# EAGLE design SARA (EAGLE 9.3.0)
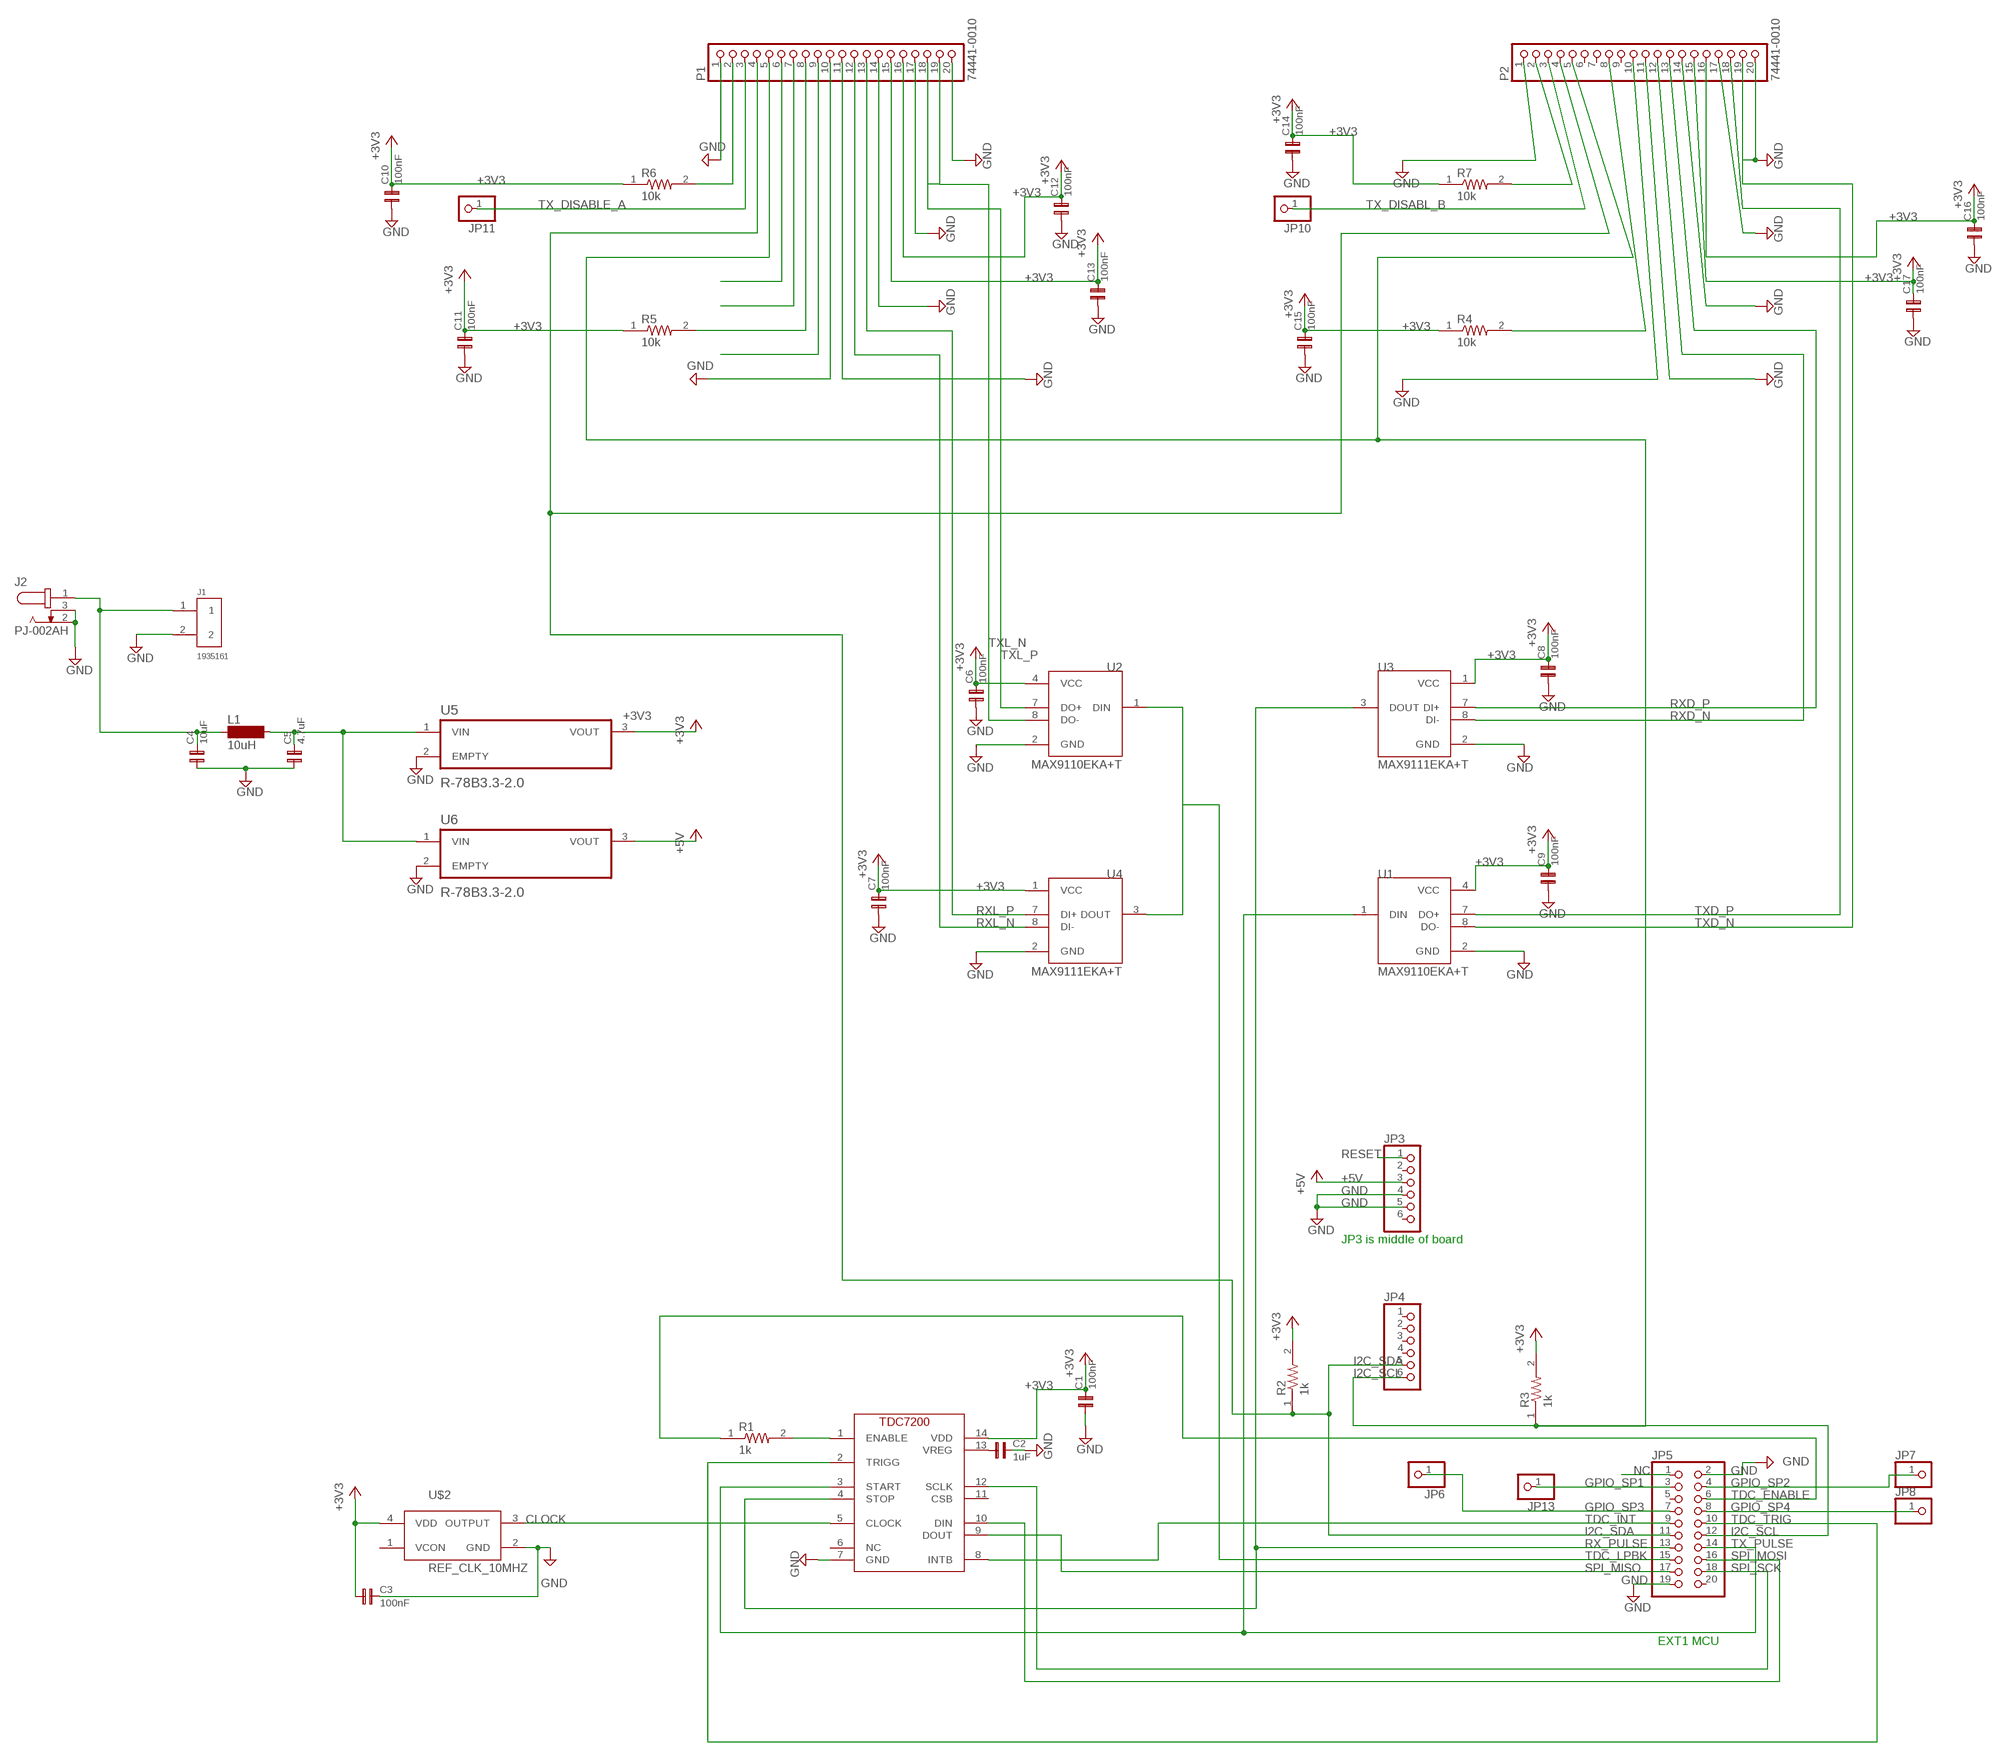
[diagram p0: schematic, sheet 1]

## Parts
C1  100nF  C0603  [0603]
C2  1uF  C0603  [0603]
C3  100nF  C0603  [0603]
C4  10uF  C0603  [0603]
C5  4.7uF  C0603  [0603]
C6  100nF  C0603  [0603]
C7  100nF  C0603  [0603]
C8  100nF  C0603  [0603]
C9  100nF  C0603  [0603]
C10  100nF  C0603  [0603]
C11  100nF  C0603  [0603]
C12  100nF  C0603  [0603]
C13  100nF  C0603  [0603]
C14  100nF  C0603  [0603]
C15  100nF  C0603  [0603]
C16  100nF  C0603  [0603]
C17  100nF  C0603  [0603]
J1  1935161  [PHOENIX_1935161]
J2  PJ-002AH  [CUI_PJ-002AH]
JP3  PINHD-1X6  [1X06]
JP4  PINHD-1X6  [1X06]
JP5  PINHD-2X10  [2X10]
JP6  PINHD-1X1  [1X01]
JP7  PINHD-1X1  [1X01]
JP8  PINHD-1X1  [1X01]
JP10  PINHD-1X1  [1X01]
JP11  PINHD-1X1  [1X01]
JP13  PINHD-1X1  [1X01]
L1  10uH  MS50  [MS50]
P1  74441-0010  [MOLEX_74441-0010]
P2  74441-0010  [MOLEX_74441-0010]
R1  1k  RES_0603  [RESC1608X55]
R2  1k  RES_0603  [RESC1608X55]
R3  1k  RES_0603  [RESC1608X55]
R4  10k  RES_0603  [RESC1608X55]
R5  10k  RES_0603  [RESC1608X55]
R6  10k  RES_0603  [RESC1608X55]
R7  10k  RES_0603  [RESC1608X55]
U1  MAX9110EKA+T  [SOT65P280X145-8N]
U2  MAX9110EKA+T  [SOT65P280X145-8N]
U3  MAX9111EKA+T  [SOT65P280X145-8N]
U4  MAX9111EKA+T  [SOT65P280X145-8N]
U5  R-78B3.3-2.0  [CONV_R-78B15-2.0]
U6  R-78B3.3-2.0  [CONV_R-78B15-2.0]
U$1  TDC72007201PW  [SOP65P640X120-14N]
U$2  REF_CLK_10MHZ  [TWETMCJANF-10.000000]

## Nets
+3V3: C1.2 C3.1 C6.2 C7.2 C8.2 C9.2 C10.2 C11.2 C12.2 C13.2 C14.2 C15.2 C16.2 C17.2 P1.15 P1.16 P2.15 P2.16 R2.2 R3.2 R4.1 R5.1 R6.1 R7.1 U1.4(VCC) U2.4(VCC) U3.1(VCC) U4.1(VCC) U5.3(VOUT) U$1.14(VDD) U$2.4(VDD)
+5V: JP3.3 U6.3(VOUT)
CLOCK: U$1.5(CLOCK) U$2.3(OUTPUT)
GND: C1.1 C2.2 C3.2 C4.1 C5.1 C6.1 C7.1 C8.1 C9.1 C10.1 C11.1 C12.1 C13.1 C14.1 C15.1 C16.1 C17.1 J1.2 J2.2 J2.3 JP3.4 JP3.5 JP5.2 JP5.19 P1.1 P1.10 P1.11 P1.14 P1.17 P1.20 P2.1 P2.11 P2.14 P2.17 P2.20 U1.2(GND) U2.2(GND) U3.2(GND) U4.2(GND) U5.2(EMPTY) U6.2(EMPTY) U$1.7(GND) U$2.2(GND)
GPIO_SP1: JP5.3 JP13.1
GPIO_SP2: JP5.4 JP7.1
GPIO_SP3: JP5.7 JP6.1
GPIO_SP4: JP5.8 JP8.1
I2C_SCL: JP4.6 JP5.12 P1.5 P2.5 R3.1
I2C_SDA: JP4.5 JP5.11 P1.4 P2.4 R2.1
N$1: P2.8 R4.2
N$2: R1.2 U$1.1(ENABLE)
N$3: P1.6
N$4: C2.1 U$1.13(VREG)
N$5: P1.7
N$6: P1.9
N$7: P2.10 ; supply symbol labelled GND
N$9: C5.2 L1.2 U5.1(VIN) U6.1(VIN)
N$18: U2.1(DIN) U4.3(DOUT)
N$19: P1.8 R5.2
N$20: P1.2 R6.2
N$21: P2.2 R7.2
N$22: C4.2 J1.1 J2.1 L1.1
NC: JP5.1
RESET: JP3.1
RX_PULSE: JP5.13 U3.3(DOUT) U$1.4(STOP)
RXD_N [Diff]: P2.12 U3.8(DI-)
RXD_P [Diff]: P2.13 U3.7(DI+)
RXL_N [Diff]: P1.12 U4.8(DI-)
RXL_P [Diff]: P1.13 U4.7(DI+)
SPI_MISO: JP5.17 U$1.9(DOUT)
SPI_MOSI: JP5.16 U$1.10(DIN)
SPI_SCK: JP5.18 U$1.12(SCLK)
TDC_ENABLE: JP5.6 R1.1
TDC_INT: JP5.9 U$1.8(INTB)
TDC_LPBK: JP5.15
TDC_TRIG: JP5.10 U$1.2(TRIGG)
TX_DISABL_B: JP10.1 P2.3
TX_DISABLE_A: JP11.1 P1.3
TX_PULSE: JP5.14 U1.1(DIN) U$1.3(START)
TXD_N [Diff]: P2.19 U1.8(DO-)
TXD_P [Diff]: P2.18 U1.7(DO+)
TXL_N [Diff]: P1.19 U2.8(DO-)
TXL_P [Diff]: P1.18 U2.7(DO+)
Unconnected: JP3.2 JP3.6 JP4.1 JP4.2 JP4.3 JP4.4 JP5.5 JP5.20 P2.6 P2.7 P2.9 U$1.6(NC) U$1.11(CSB) U$2.1(VCON)

## Notes on the sheet
- JP3 is middle of board
- EXT1 MCU

## Library data of the parts
C1-C17 = capsmd:C0603
J1 = Screw Block:1935161: Conn Terminal Blocks 2 POS 5mm Solder ST Thru-Hole 16A; AVAILABILITY: Unavailable; DESCRIPTION: Conn Terminal Blocks 2 POS 5mm Solder ST Thru-Hole 16A; MF: Phoenix Contact; MP: 1935161; PACKAGE: None; PRICE: None
J2 = PJ-002AH:PJ-002AH: 2.0 mm Center Pin, 5.0 A, Right Angle, Through Hole, Dc Power Jack Connector; AVAILABILITY: Unavailable; CUI_PURCHASE_URL: https://www.cui.com/product/interconnect/dc-power-connectors/jacks/2.0-mm-center-pin/pj-002ah?utm_source=snapeda.com&utm_medium=referral&utm_campaign=snapedaBOM; DESCRIPTION: 2.0 mm Center Pin, 5.0 A, Right Angle, Through Hole, Dc Power Jack Connector; MF: CUI Inc.; MP: PJ-002AH; PACKAGE: None; PRICE: None
JP3 JP4 = pinhead:PINHD-1X6: PIN HEADER
JP5 = pinhead:PINHD-2X10: PIN HEADER
JP6-JP8 JP10 JP11 JP13 = pinhead:PINHD-1X1: PIN HEADER
L1 = inductor-neosid:MS50: INDUCTOR SMD power inductor; OC_FARNELL: unknown; OC_NEWARK: unknown
P1 P2 = 74441-0010:74441-0010: 0.80mm Pitch SFP, SFP Plus (SFP+) Host Connector, Z-Axis Pluggable, Right Angle, SMT, 20 Circuits, 0.76µm Gold (Au); AVAILABILITY: Unavailable; DESCRIPTION: 0.80mm Pitch SFP, SFP Plus _SFP+_ Host Connector, Z-Axis Pluggable, Right Angle, SMT, 20 Circuits, 0.76µm Gold _Au_; MF: Molex; MP: 74441-0010; PACKAGE: None; PRICE: None
R1-R7 = RES_0603:RES_0603; AVAILABILITY: Unavailable; DESCRIPTION: Res Smd 0.047 Ohm 1% 0.4w 0603; MF: Vishay Dale; MP: WSLP0603R0470FEB; PACKAGE: 0603 Vishay Dale; PRICE: None
U1 U2 = MAX9110EKA_T:MAX9110EKA+T: The MAX9110 is a single LVDS transmitter; AVAILABILITY: Unavailable; DESCRIPTION: Single/Dual Lvds Line Driver With u; MF: Maxim Integrated; MP: MAX9110EKA+T; PACKAGE: SOT-23 Maxim Integrated; PRICE: None
U3 U4 = MAX9111EKA_T:MAX9111EKA+T
U5 U6 = R-78B3.3-2.0:R-78B3.3-2.0: None; AVAILABILITY: Unavailable; DESCRIPTION: Switching Regulator 4.75-32Vin 3.3Vo 2A; MF: Recom Power; MP: R-78B3.3-2.0; PACKAGE: SIP-3 Recom Power; PRICE: None
U$1 = TDC7200:TDC7200: TDC7200 chip made by Joe
U$2 = Ref_Clk:REF_CLK_10MHZ

## Net classes
1 Diff: width 0.254 mm, clearance 0.051 mm

## Board
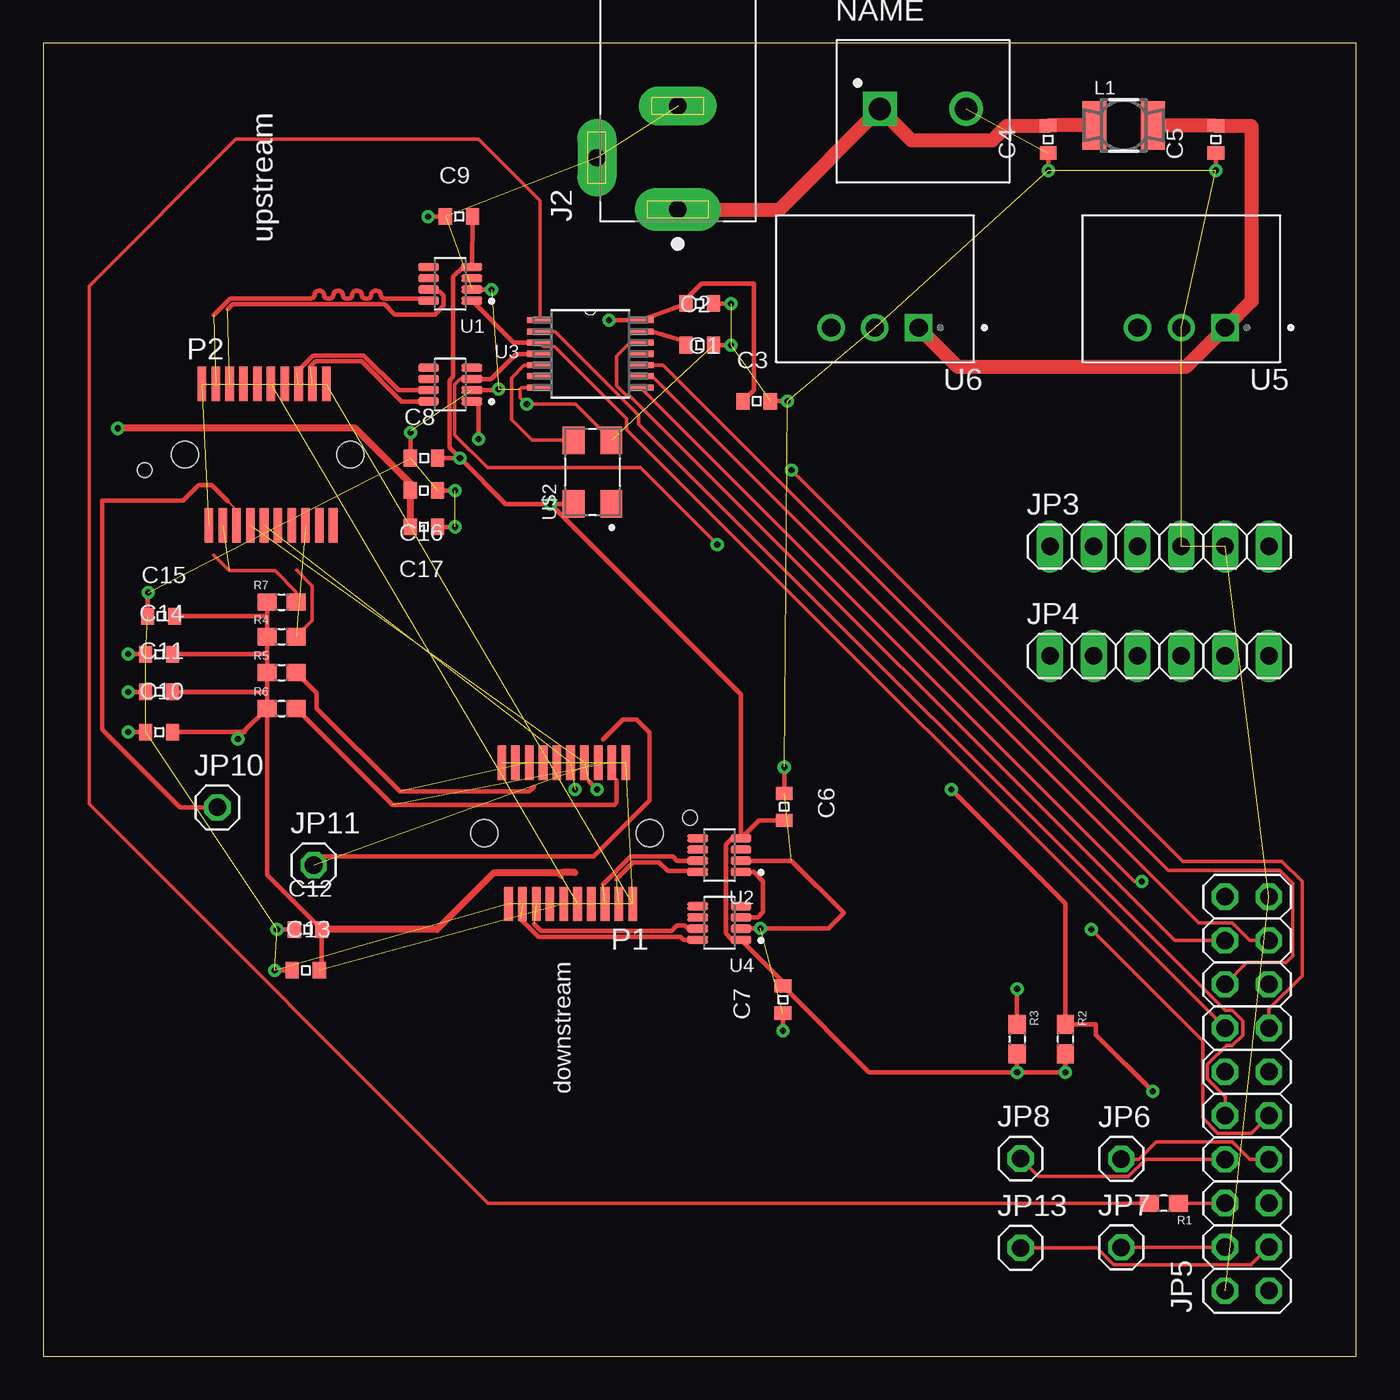
[diagram p1: board, top side]
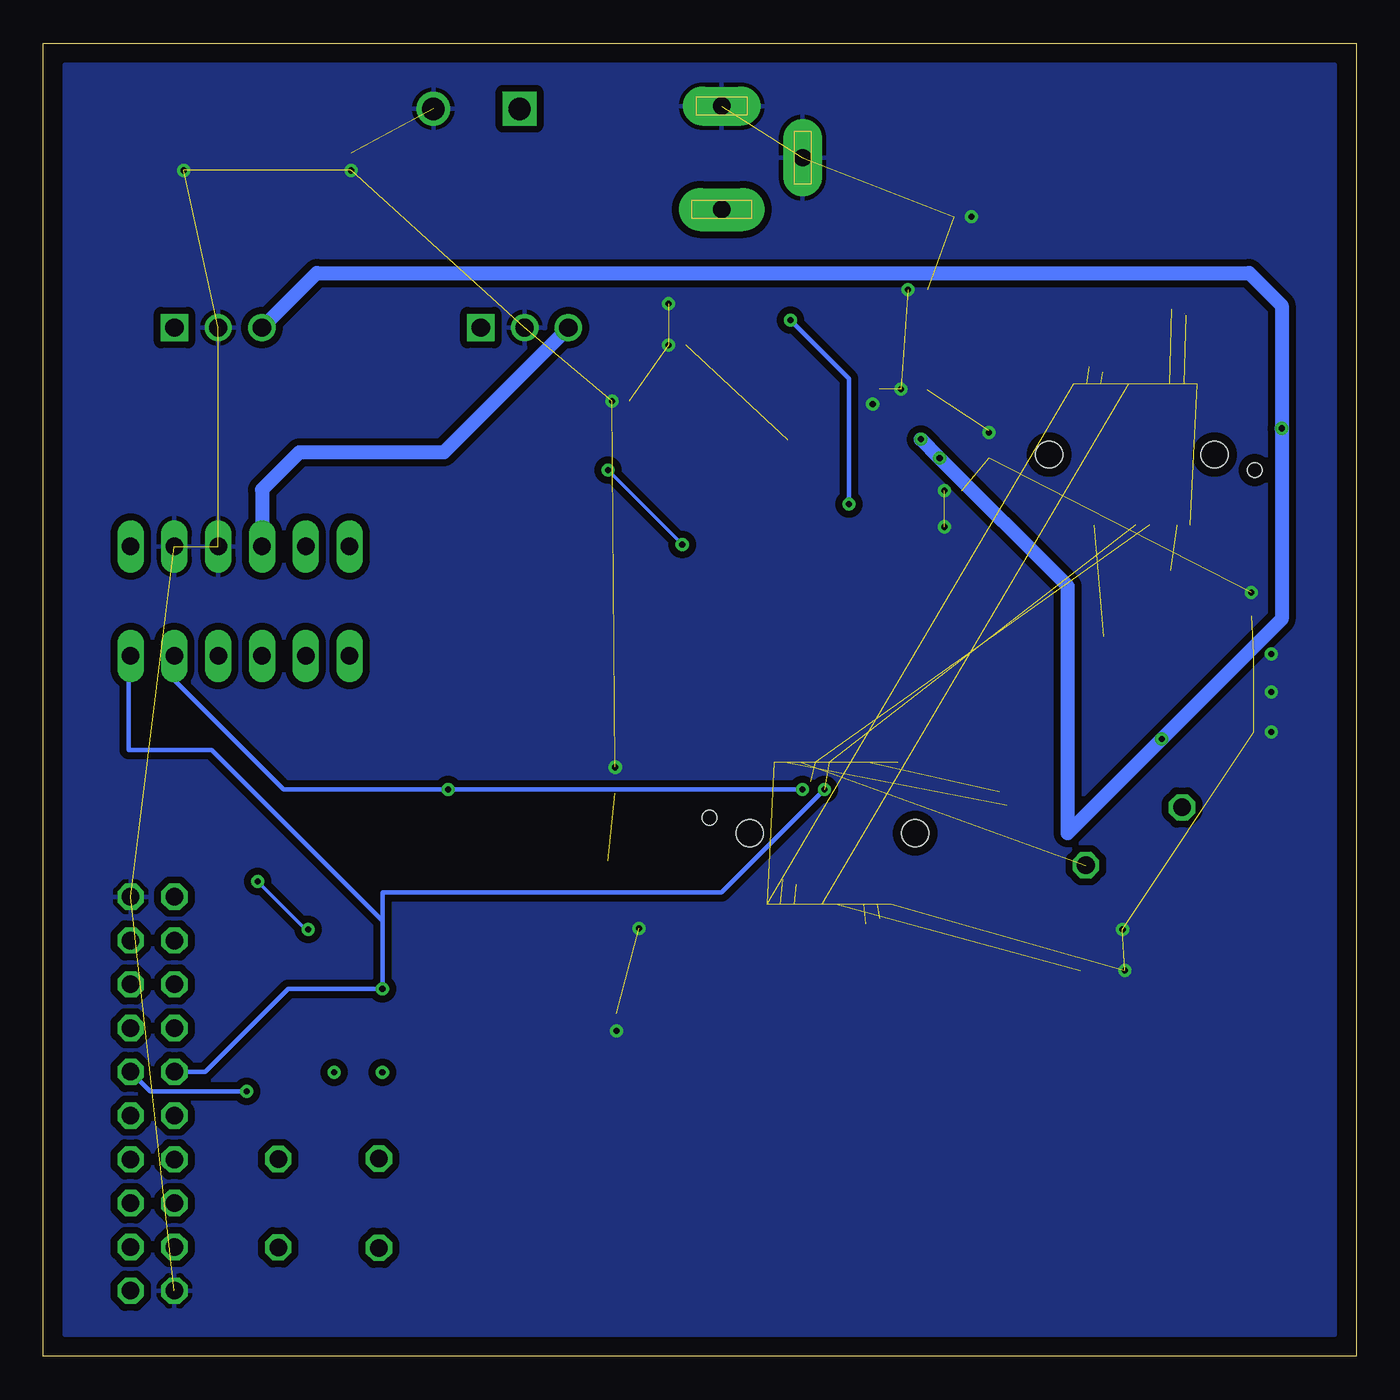
[diagram p2: board, bottom side, seen from below]

Size 76.2 x 76.2 mm. Coordinates in mm from the lower left corner, seen from the top.
Outline: 0,0 76.2,0 76.2,76.2 0,76.2 0,0
Copper layers (1*16): Top 0.035mm / dielectric 1.5mm / Bottom 0.035mm
Design rules "default *": minimum track width 6mil, minimum drill 0.35mm, track to track 3mil, track to pad 6mil, pad to pad 6mil, via to via 6mil, smd to smd 6mil, copper to edge 20mil, drill to drill 6mil, minimum pad ring 10mil, minimum via ring 8mil, stop-mask expansion 4mil, vias tented up to drill 0mil, thermal gap 10mil

### Footprints (pad centres in the part's own frame; a part is rotated, then mirrored left to right if it is on the bottom)
0603 = smd 0.762 x 0.965: 1 -0.787,0; 2 0.787,0
PHOENIX_1935161 = drill 1.3 square: 1 -2.5,0 | drill 1.3: 2 2.5,0
CUI_PJ-002AH = drill 1 pad 2.5 long: 1 0,0 | drill 1 pad 2.25 long: 2 6,0; 3 3,4.7
1X06 = drill 1.016 long: 1 -6.35,0; 2 -3.81,0; 3 -1.27,0; 4 1.27,0; 5 3.81,0; 6 6.35,0
2X10 = drill 1.016 octagon: 1 -11.43,-1.27; 2 -11.43,1.27; 3 -8.89,-1.27; 4 -8.89,1.27; 5 -6.35,-1.27; 6 -6.35,1.27; 7 -3.81,-1.27; 8 -3.81,1.27; 9 -1.27,-1.27; 10 -1.27,1.27; 11 1.27,-1.27; 12 1.27,1.27; 13 3.81,-1.27; 14 3.81,1.27; 15 6.35,-1.27; 16 6.35,1.27; 17 8.89,-1.27; 18 8.89,1.27; 19 11.43,-1.27; 20 11.43,1.27
1X01 = drill 1.016 octagon: 1 0,0
MS50 = smd 2.8 x 1.4: 1 0,-1.7; 2 0,1.7
MOLEX_74441-0010 = smd 0.5 x 2: 1 -3.2,-4.1; 2 -2.4,-4.1; 3 -1.6,-4.1; 4 -0.8,-4.1; 5 0,-4.1; 6 0.8,-4.1; 7 1.6,-4.1; 8 2.4,-4.1; 9 3.2,-4.1; 10 4,-4.1; 11 3.6,4.1; 12 2.8,4.1; 13 2,4.1; 14 1.2,4.1; 15 0.4,4.1; 16 -0.4,4.1; 17 -1.2,4.1; 18 -2,4.1; 19 -2.8,4.1; 20 -3.6,4.1 | hole 0.85: -6.93,-0.9 | hole 1.55: -4.6,0; 5,0
RESC1608X55 = smd 1.1 x 1: 1 -0.85,0; 2 0.85,0
SOT65P280X145-8N = smd 1.21 x 0.48: 1 -1.255,0.975; 2 -1.255,0.325; 3 -1.255,-0.325; 4 -1.255,-0.975; 5 1.255,-0.975; 6 1.255,-0.325; 7 1.255,0.325; 8 1.255,0.975
CONV_R-78B15-2.0 = drill 1.06 square: 1 0,0 | drill 1.06: 2 2.54,0; 3 5.08,0
SOP65P640X120-14N = smd 1.473 x 0.356: 1 -2.921,1.956; 2 -2.921,1.295; 3 -2.921,0.66; 4 -2.921,0; 5 -2.921,-0.66; 6 -2.921,-1.295; 7 -2.921,-1.956; 8 2.921,-1.956; 9 2.921,-1.295; 10 2.921,-0.66; 11 2.921,0; 12 2.921,0.66; 13 2.921,1.295; 14 2.921,1.956
TWETMCJANF-10.000000 = smd 1.6 x 1.25: 1 -1.85,-1.1; 2 1.85,-1.1; 3 1.85,1.1; 4 -1.85,1.1

### Placement (x,y rotation side)
C1  38.1,61.09 180 top
C2  38.1,58.67 0 top
C3  41.4,55.42 0 top
C4  58.32,70.61 90 top
C5  68.05,70.61 90 top
C6  43,31.88 270 top
C7  42.93,20.7 90 top
C8  22.1,52.12 0 top
C9  24.13,66.14 0 top
C10  6.73,36.22 0 top
C11  6.73,38.56 0 top
C12  15.37,24.77 0 top
C13  15.24,22.4 0 top
C14  6.73,40.74 0 top
C15  6.86,42.95 0 top
C16  22.1,50.24 180 top
C17  22.1,48.13 180 top
J1  51.05,72.39 0 top
J2  36.83,66.55 90 top
JP3  64.77,46.99 0 top
JP4  64.77,40.64 0 top
JP5  69.85,15.24 90 top
JP6  62.56,11.46 0 top
JP7  62.56,6.32 0 top
JP8  56.72,11.48 0 top
JP10  10.11,31.85 0 top
JP11  15.7,28.5 0 top
JP13  56.72,6.3 0 top
L1  62.69,71.42 270 top
P1  30.61,30.35 180 top
P2  12.83,52.32 0 top
R1  65.02,8.89 180 top
R2  59.31,18.41 270 top
R3  56.52,18.41 270 top
R4  13.84,41.76 0 top
R5  13.84,39.67 0 top
R6  13.84,37.59 0 top
R7  13.84,43.76 0 top
U1  23.62,62.23 180 top
U2  39.24,29.08 180 top
U3  23.62,56.39 180 top
U4  39.24,25.15 180 top
U5  68.58,59.69 180 top
U6  50.8,59.69 180 top
U$1  31.75,58.17 0 top
U$2  31.88,51.31 90 top

### Tracks (layer width: path | path; a pad name or v marks a point on that pad's centre or on a via)
+3V3  (via drill 0.35)  (4 unrouted)
  Top 0.152: 42.93,21.74 C7.2
  Top 0.254: 12.99,42.95 R4.1 12.99,40.74 | v11.3,35.81 11.3,35.95 11.35,35.95 11.7,36.3 | 12.99,40.74 R5.1 | R5.1 12.99,38.56 | 12.99,38.56 R6.1 | R6.1 11.7,36.3 | 42.93,21.74 U4.1 39.98,24.17 39.61,24.54 39.61,29.69 39.98,30.06 U2.4 | U2.4 41.53,31.09 C6.2 | U3.1 arc-90 25.27,55.02 v25.27,53.21 | C8.2 v24.18,52.12 | C9.2 U1.4 24.36,63.2 23.8,62.65 23.8,56.84 23.57,56.61 23.57,52.73 v24.18,52.12 | C15.2 12.99,42.95 | 12.99,42.95 R7.1 | C14.2 12.99,40.74 | C11.2 12.99,38.56 | C10.2 11.7,36.22 11.7,36.3 | 21.29,50.22 C16.2 21.31,50.65 | 30.88,28.05 30.86,28.07 | 29.97,27.94 29.97,28.07 30.1,28.07 30.07,28.04 29.97,27.94 | C13.2 16.15,22.53 C12.2 12.99,27.93 R6.1 | C3.1 41.25,56.06 41.25,62.23 38.2,62.23 37.31,61.34 C1.2 37.25,61.06 35.41,60.39 U$1.14 v32.84,60.12 | R2.2 v59.31,16.48 v56.52,16.48 | R3.2 v56.52,16.48 | U$2.4 v29.45,49.46 | v56.52,16.48 47.93,16.48 C7.2 | v29.45,49.46 26.84,49.46 v24.18,52.12 | U2.4 40.5,38.41 v29.45,49.46 | 12.99,29.73 R5.1 | 30.08,27.83 29.97,27.94
  Top 0.406: v4.33,53.85 18.11,53.85 21.31,50.65 | C17.2 C16.2 | 30.86,28.07 30.1,28.07 | C12.2 22.86,24.77 26.13,28.04 30.07,28.04
  Bottom 0.254: v32.84,60.12 29.45,56.72 v29.45,49.46
  Bottom 0.813: U5.3 60.33,62.87 6.22,62.87 4.33,60.98 v4.33,53.85 4.33,42.78 v11.3,35.81 16.75,30.37 16.75,44.69 v24.18,52.12 v25.27,53.21
+5V
  Bottom 0.813: U6.3 52.96,52.45 61.34,52.45 63.5,50.29 JP3.3
CLOCK
  Top 0.203: U$2.3 28.38,53.16 27.18,54.36 27.18,56.77 27.91,57.51 U$1.5
GND  (via drill 0.35)  (40 unrouted)
  Top 0.203: U$1.7 27.76,56.21 27.69,56.13 27.69,55.63 v28.07,55.24 30.89,55.24 U$2.2
  Top 0.254: U4.2 v41.63,24.82 45.56,24.82 46.46,25.72 43.42,28.76 U2.2 | U1.2 v26.01,61.91 | C5.1 v68.05,68.81 | C16.1 v23.9,50.24 | C2.2 v39.9,58.67 | C4.1 v58.32,68.81 | C9.1 v22.33,66.14 | C10.1 v4.93,36.22 | C11.1 v4.93,38.56 | C12.1 v13.57,24.77 | C13.1 v13.44,22.4 | C14.1 v4.93,40.74 | C3.2 v43.2,55.42 | C17.1 v23.9,48.13 | C6.1 v43,34.19 | C1.1 v39.9,61.09 | C7.1 v42.93,18.9 | U3.2 26.34,56.06 v26.42,56.13 | C15.1 6.07,44.3 v6.1,44.32 | C8.1 21.31,53.7 21.34,53.72 v21.34,53.59
  pour Bottom (isolate 0.406): 1.27,1.27 1.27,74.93 74.93,74.93 74.93,1.27
GPIO_SP1
  Top 0.203: JP13.1 61.15,6.3 62.14,5.31 70.08,5.31 JP5.3
GPIO_SP2
  Top 0.203: JP5.4 68.56,6.33 JP7.1
GPIO_SP3
  Top 0.203: JP6.1 62.59,11.43 63.58,11.43 64.59,12.45 69,12.45 70.02,11.43 JP5.7
GPIO_SP4
  Top 0.203: JP5.8 63.97,11.43 62.98,10.44 57.76,10.44 JP8.1
I2C_SCL  (via drill 0.35)  (2 unrouted)
  Top 0.254: v56.52,21.34 R3.1 | 30.88,32.91 v30.86,32.89
  Bottom 0.254: JP5.12 66.8,16.51 61.98,21.34 v56.52,21.34 56.52,25.27 | v30.86,32.89 36.83,26.92 56.52,26.92 56.52,25.27 | 56.52,25.27 66.42,35.18 71.25,35.18 71.25,40.51 JP4.6
I2C_SDA  (via drill 0.35)  (2 unrouted)
  Top 0.254: 31.68,33.34 v32.13,32.89 | R2.1 59.18,19.39 59.31,19.52 | v52.7,32.89 59.31,26.29 R2.1 | v64.39,15.37 61.09,18.67 61.09,19.27 R2.1
  Bottom 0.254: v32.13,32.89 v52.7,32.89 62.23,32.89 68.58,39.24 JP4.5 | JP5.11 69.98,15.37 v64.39,15.37
N$1  (1 unrouted)
  Top 0.203: 14.7,41.78 R4.2 15.62,42.69 15.62,44.7 14.7,45.62
N$2
  Top 0.203: R1.2 25.82,8.89 2.67,32.05 2.67,62.1 11.18,70.61 25.27,70.61 28.83,67.06 U$1.1
N$4
  Top 0.254: U$1.13 35.35,59.46 37.02,58.96 C2.1
N$9
  Top 0.813: L1.2 64.41,71.4 C5.2 70.08,71.4 70.1,71.37 70.1,61.21 U5.1 66.29,57.4 53.09,57.4 U6.1
N$18
  Top 0.254: U2.1 41.23,28.11 41.78,27.56 41.78,25.78 41.47,25.47 U4.3
N$19  (1 unrouted)
  Top 0.254: 28.48,33.05 28.19,32.77 20.7,32.77 15.88,37.59 15.88,38.49 R5.2
N$20  (1 unrouted)
  Top 0.254: 33.28,33.41 33.27,33.4 33.27,32.13 33.15,32 20.28,32 R6.2
N$21  (1 unrouted)
  Top 0.203: R7.2 14.69,44.36 13.46,45.59 10.79,45.59 9.9,46.49
N$22
  Top 0.203: 58.34,71.37 C4.2
  Top 0.813: L1.1 58.34,71.42 C4.2 57.48,71.4 55.92,71.4 55.07,70.55 50.39,70.55 J1.1 42.71,66.55 J2.1
RX_PULSE  (via drill 0.35)
  Top 0.203: v43.43,51.44 66.14,28.73 71.87,28.73 73.05,27.55 73.05,22.08 71.12,20.15 JP5.13 | U3.3 24.2,56.71 23.88,56.39 23.88,53.47 25.78,51.56 34.67,51.56 v39.12,47.12
  Top 0.254: U$1.4 27.43,58.17 25.98,56.71 U3.3
  Bottom 0.203: v43.43,51.44 39.24,47.24 38.99,47.24 v39.12,47.12
RXD_N  (1 unrouted)
  Top 0.254: 15.5,57.43 15.82,57.75 18.47,57.75 20.81,55.41 U3.8
RXD_P  (1 unrouted)
  Top 0.254: 14.7,57.1 15.68,58.08 18.61,58.08 20.62,56.06 U3.7
RXL_N  (1 unrouted)
  Top 0.254: 27.68,25.43 28.76,24.35 36.99,24.35 37.17,24.17 U4.8
RXL_P  (1 unrouted)
  Top 0.254: 28.48,25.09 28.9,24.68 36.45,24.68 36.79,25.02 37.21,25.02 37.47,24.77 37.93,24.77 U4.7
SPI_MISO
  Top 0.203: JP5.17 70.02,24.13 69,25.15 67.06,25.15 64.02,28.19 64.01,28.19 35.33,56.87 U$1.9
SPI_MOSI
  Top 0.203: U$1.10 35.97,57.51 65.28,28.19 71.75,28.19 72.52,27.43 72.52,23.24 72.14,22.86 69.85,22.86 JP5.16
SPI_SCK
  Top 0.203: JP5.18 65.66,24.13 34.01,55.78 33.83,55.78 33.27,56.33 33.27,58.04 34.06,58.83 U$1.12
TDC_ENABLE
  Top 0.203: JP5.6 R1.1
TDC_INT  (via drill 0.35)
  Top 0.203: U$1.8 63.32,27.56 v63.75,27.56 | v60.83,24.77 67.28,18.31 67.28,15.11 67.28,13.83 68.16,12.95 70.1,12.95 JP5.9
  Bottom 0.203: v63.75,27.56 60.96,24.77 v60.83,24.77
TDC_TRIG
  Top 0.203: JP5.10 68.58,15.07 67.56,16.09 67.56,16.93 68.67,18.03 69,18.03 69.6,18.63 69.6,19.47 69,20.07 68.58,20.07 34.54,54.1 34.54,54.61 29.69,59.46 U$1.2
TX_DISABL_B
  Top 0.152: 10.7,49.62 11.23,49.1 P2.3
  Top 0.254: 10.7,49.62 9.78,50.55 9.02,50.55 8.13,49.66 3.43,49.66 3.43,36.37 7.95,31.85 JP10.1
TX_DISABLE_A  (1 unrouted)
  Top 0.254: JP11.1 16.2,29.01 31.93,29.01 35.18,32.26 35.18,36.2 34.42,36.96 33.66,36.96 32.48,35.78
TX_PULSE
  Top 0.203: U$1.3 28.83,58.8 29.03,58.6 29.67,58.6 33.86,54.41 33.86,53.77 JP5.14
  Top 0.254: U1.1 27.31,58.83 U$1.3
TXD_N  (2 unrouted)
  Top 0.254: 9.9,60.42 9.98,60.51 | 9.98,60.51 10.85,61.38 15.52,61.38 arc90 15.75,61.6 arc-90 15.97,61.82 16.07,61.82 arc-90 16.3,61.6 arc90 16.52,61.38 16.62,61.38 arc90 16.84,61.6 arc-90 17.07,61.82 17.17,61.82 arc-90 17.39,61.6 arc90 17.62,61.38 17.72,61.38 arc90 17.94,61.6 arc-90 18.16,61.82 18.27,61.82 arc-90 18.49,61.6 arc90 18.71,61.38 18.82,61.38 arc90 19.04,61.6 arc-90 19.26,61.82 19.37,61.82 arc-90 19.59,61.6 arc90 19.81,61.38 22.24,61.38 U1.8 | 9.9,60.42 | 9.98,60.51
TXD_P  (1 unrouted)
  Top 0.254: 10.7,60.76 10.99,61.05 19.81,61.05 20.41,60.45 22.73,60.45 23.25,60.97 23.25,61.54 23.02,61.77 22.47,61.77 22.35,61.89 U1.7
TXL_N  (1 unrouted)
  Top 0.254: 33.28,27.68 33.26,27.7 34.23,28.66 35.75,28.66 36.25,28.16 37.94,28.16 U2.8
TXL_P  (1 unrouted)
  Top 0.254: 32.48,27.38 34.09,28.99 36.54,28.99 36.77,28.76 U2.7 37.92,28.83

### Text on the board
tPlace: upstream
tNames: downstream